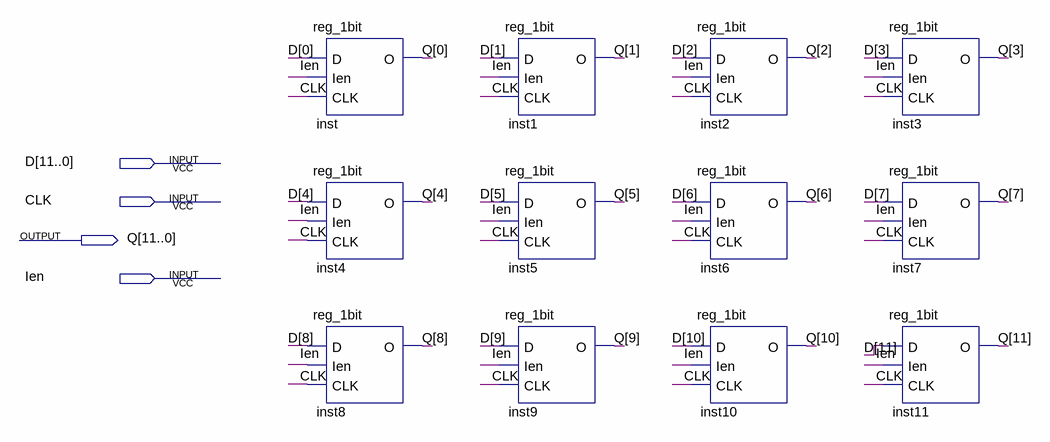
[diagram p0: schematic sheet]
// Quartus schematic reg_12bits.bdf as structural Verilog: 12 symbols, 4 pins
module reg_12bits (
  input  [11:0] D,
  input  CLK,
  input  Ien,
  output [11:0] Q
);

  reg_1bit inst (.D(D[0]), .Ien(Ien), .CLK(CLK), .O(Q[0]));
  reg_1bit inst4 (.D(D[4]), .Ien(Ien), .CLK(CLK), .O(Q[4]));
  reg_1bit inst8 (.D(D[8]), .Ien(Ien), .CLK(CLK), .O(Q[8]));
  reg_1bit inst1 (.D(D[1]), .Ien(Ien), .CLK(CLK), .O(Q[1]));
  reg_1bit inst5 (.D(D[5]), .Ien(Ien), .CLK(CLK), .O(Q[5]));
  reg_1bit inst9 (.D(D[9]), .Ien(Ien), .CLK(CLK), .O(Q[9]));
  reg_1bit inst2 (.D(D[2]), .Ien(Ien), .CLK(CLK), .O(Q[2]));
  reg_1bit inst6 (.D(D[6]), .Ien(Ien), .CLK(CLK), .O(Q[6]));
  reg_1bit inst10 (.D(D[10]), .Ien(Ien), .CLK(CLK), .O(Q[10]));
  reg_1bit inst3 (.D(D[3]), .Ien(Ien), .CLK(CLK), .O(Q[3]));
  reg_1bit inst7 (.D(D[7]), .Ien(Ien), .CLK(CLK), .O(Q[7]));
  reg_1bit inst11 (.D(D[11]), .Ien(Ien), .CLK(CLK), .O(Q[11]));
endmodule
